# EAGLE design Axoloti1 (EAGLE 6.5.0)
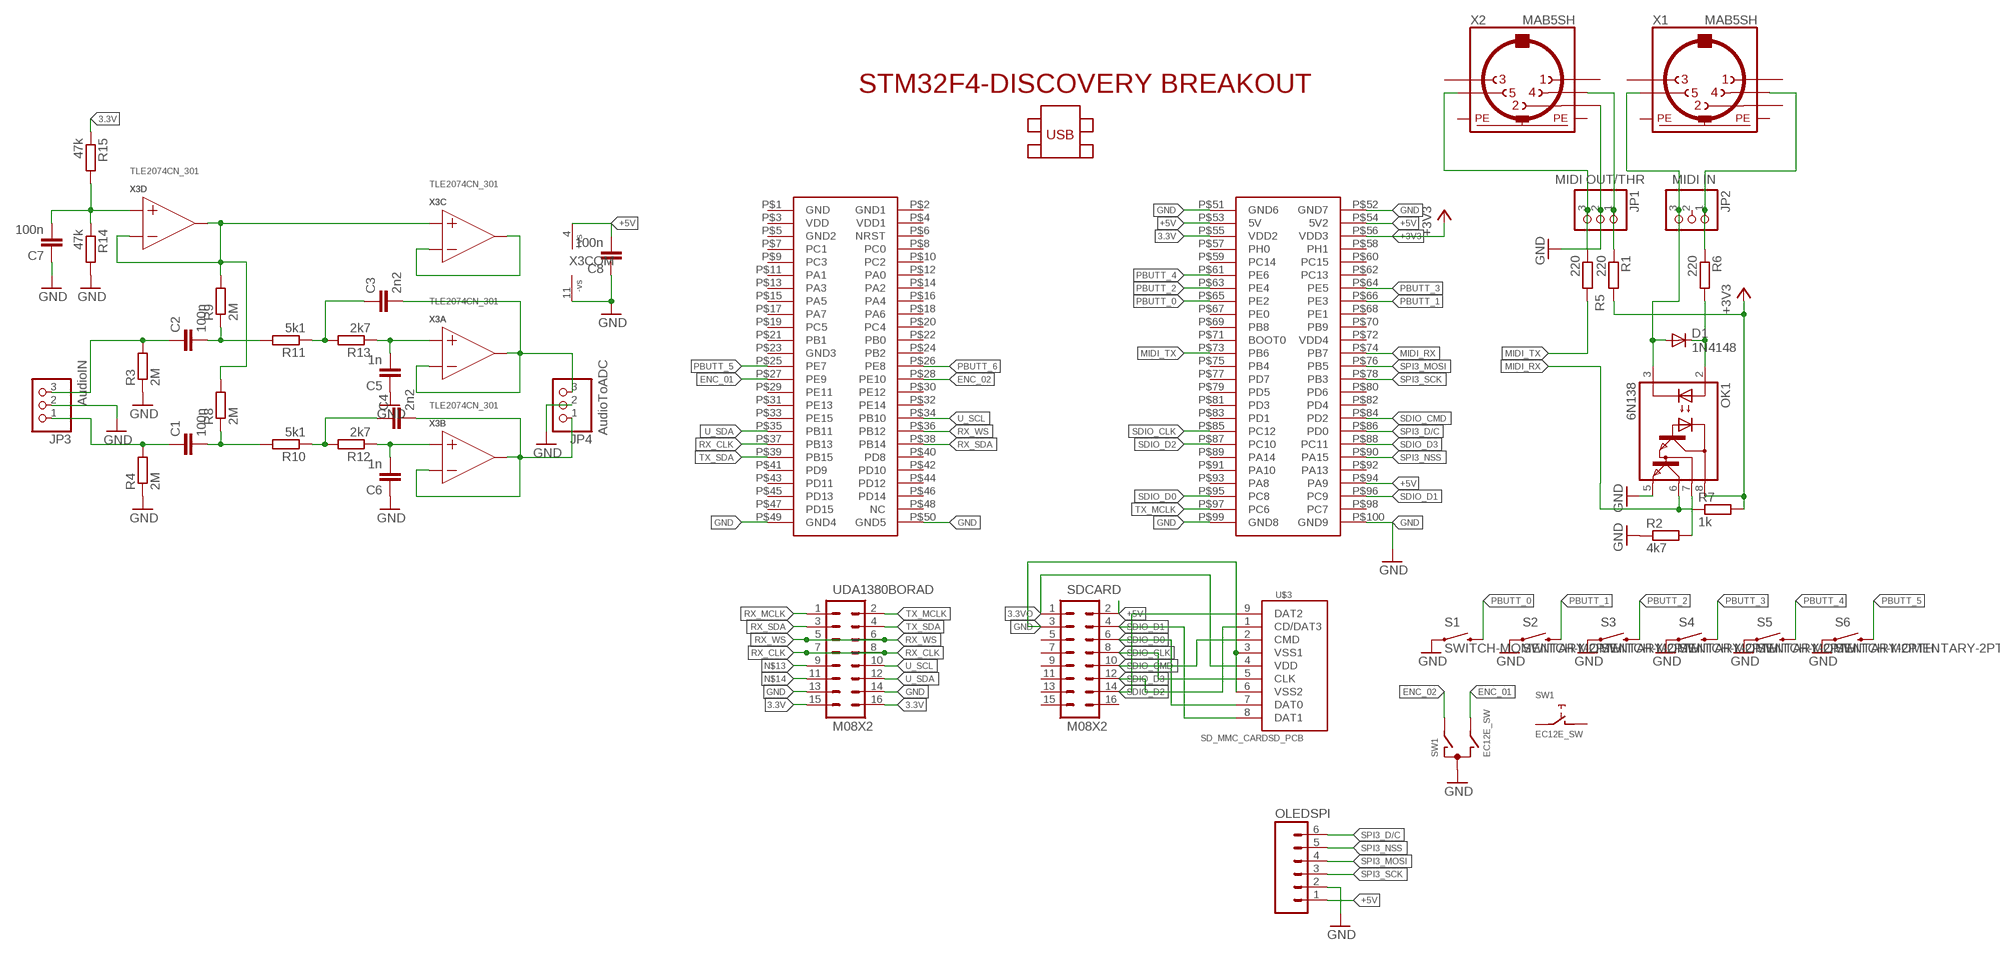
[diagram p0: schematic, sheet 1]

## Parts
C1  100n  C-EU025-025X050  [C025-025X050]
C2  100n  C-EU025-025X050  [C025-025X050]
C3  2n2  C-EU025-025X050  [C025-025X050]
C4  2n2  C-EU025-025X050  [C025-025X050]
C5  1n  C-EU025-025X050  [C025-025X050]
C6  1n  C-EU025-025X050  [C025-025X050]
C7  100n  C-EU025-025X050  [C025-025X050]
C8  100n  C-EU025-025X050  [C025-025X050]
D1  1N4148  1N4148DO35-7  [DO35-7]
JP1  MIDI OUT/THR  PINHD-1X3  [1X03]
JP2  MIDI IN  PINHD-1X3  [1X03]
JP3  AudioIN  PINHD-1X3  [1X03]
JP4  AudioToADC  PINHD-1X3  [1X03]
OK1  6N138  [DIL08]
OLEDSPI  M06SIP  [1X06]
R1  220  R-EU_0204/7  [0204/7]
R2  4k7  R-EU_0204/7  [0204/7]
R3  2M  R-EU_0204/7  [0204/7]
R4  2M  R-EU_0204/7  [0204/7]
R5  220  R-EU_0204/7  [0204/7]
R6  220  R-EU_0204/7  [0204/7]
R7  1k  R-EU_0204/7  [0204/7]
R8  2M  R-EU_0204/7  [0204/7]
R9  2M  R-EU_0204/7  [0204/7]
R10  5k1  R-EU_0204/7  [0204/7]
R11  5k1  R-EU_0204/7  [0204/7]
R12  2k7  R-EU_0204/7  [0204/7]
R13  2k7  R-EU_0204/7  [0204/7]
R14  47k  R-EU_0204/7  [0204/7]
R15  47k  R-EU_0204/7  [0204/7]
S1  SWITCH-MOMENTARY-2PTH  [TACTILE-PTH]
S2  SWITCH-MOMENTARY-2PTH  [TACTILE-PTH]
S3  SWITCH-MOMENTARY-2PTH  [TACTILE-PTH]
S4  SWITCH-MOMENTARY-2PTH  [TACTILE-PTH]
S5  SWITCH-MOMENTARY-2PTH  [TACTILE-PTH]
S6  SWITCH-MOMENTARY-2PTH  [TACTILE-PTH]
SDCARD  M08X2  [2X8]
SW1  EC12E_SW  [ALPS_EC12E_SW]
U$1  STM32F4-DISCOVERY  [STM32F4-DISCOVERY]
U$3  SD_MMC_CARDSD_PCB  [SD-MMC-CARD]
UDA1380BORAD  M08X2  [2X8]
X1  MAB5SH  [MAB5SH]
X2  MAB5SH  [MAB5SH]
X3  TLE2074CN_301  [DIL14]

## Nets
3.3V: R15.1 U$1.P$55(VDD2) UDA1380BORAD.15 UDA1380BORAD.16
3.3VO: SDCARD.1 U$3.4(VDD)
+3V3: OK1.8(VCC) R1.2 R7.2 U$1.P$56(VDD3)
+5V: C8.2 OLEDSPI.1 SDCARD.2 U$1.P$53(5V) U$1.P$54(5V2) U$1.P$94(PA9) X3.4(COM:+VS)
ENC_01: SW1.B U$1.P$27(PE9)
ENC_02: SW1.A U$1.P$28(PE10)
GND: C5.1 C6.1 C7.1 C8.1 JP1.2 JP3.2 JP4.2 OK1.5(GND) OLEDSPI.2 R2.1 R3.1 R4.1 R14.2 S1.1 S2.1 S3.1 S4.1 S5.1 S6.1 SDCARD.3 SW1.C U$1.P$49(GND4) U$1.P$50(GND5) U$1.P$51(GND6) U$1.P$52(GND7) U$1.P$99(GND8) U$1.P$100(GND9) U$3.3(VSS1) U$3.6(VSS2) UDA1380BORAD.13 UDA1380BORAD.14 X2.2 X3.11(COM:-VS)
MIDI_RX: OK1.6(VO) R7.1 U$1.P$74(PB7)
MIDI_TX: R5.2 U$1.P$73(PB6)
N$1: JP1.3 R5.1 X2.5
N$2: C4.2 JP4.1 X3.6(B:-IN) X3.7(B:OUT)
N$3: OK1.7(VB) R2.2
N$4: C3.2 JP4.3 X3.1(A:OUT) X3.2(A:-IN)
N$5: C5.2 R13.1 X3.3(A:+IN)
N$6: C3.1 R11.1 R13.2
N$7: C4.1 R10.1 R12.2
N$8: C6.2 R12.1 X3.5(B:+IN)
N$9: C2.2 R9.1 R11.2
N$10: C1.2 R8.1 R10.2
N$11: C1.1 JP3.1 R4.2
N$12: C2.1 JP3.3 R3.2
N$13: UDA1380BORAD.9
N$14: UDA1380BORAD.11
N$15: JP1.1 R1.1 X2.4
N$16: D1.A JP2.3 OK1.3(C) X1.5
N$18: D1.C OK1.2(A) R6.2
N$21: JP2.1 R6.1 X1.4
N$22: R8.2 R9.2 X3.10(C:+IN) X3.13(D:-IN) X3.14(D:OUT)
N$23: C7.2 R14.1 R15.2 X3.12(D:+IN)
N$24: X3.8(C:OUT) X3.9(C:-IN)
PBUTT_0: S1.3 U$1.P$65(PE2)
PBUTT_1: S2.3 U$1.P$66(PE3)
PBUTT_2: S3.3 U$1.P$63(PE4)
PBUTT_3: S4.3 U$1.P$64(PE5)
PBUTT_4: S5.3 U$1.P$61(PE6)
PBUTT_5: S6.3 U$1.P$25(PE7)
PBUTT_6: U$1.P$26(PE8)
RX_CLK: U$1.P$37(PB13) UDA1380BORAD.7 UDA1380BORAD.8
RX_MCLK: UDA1380BORAD.1
RX_SDA: U$1.P$38(PB14) UDA1380BORAD.3
RX_WS: U$1.P$36(PB12) UDA1380BORAD.5 UDA1380BORAD.6
SDIO_CLK: SDCARD.8 U$1.P$85(PC12) U$3.5(CLK)
SDIO_CMD: SDCARD.10 U$1.P$84(PD2) U$3.2(CMD)
SDIO_D0: SDCARD.6 U$1.P$95(PC8) U$3.7(DAT0)
SDIO_D1: SDCARD.4 U$1.P$96(PC9) U$3.8(DAT1)
SDIO_D2: SDCARD.14 U$1.P$87(PC10) U$3.9(DAT2)
SDIO_D3: SDCARD.12 U$1.P$88(PC11) U$3.1(CD/DAT3)
SPI3_D/C: OLEDSPI.6 U$1.P$86(PD0)
SPI3_MOSI: OLEDSPI.4 U$1.P$76(PB5)
SPI3_NSS: OLEDSPI.5 U$1.P$90(PA15)
SPI3_SCK: OLEDSPI.3 U$1.P$78(PB3)
TX_MCLK: U$1.P$97(PC6) UDA1380BORAD.2
TX_SDA: U$1.P$39(PB15) UDA1380BORAD.4
U_SCL: U$1.P$34(PB10) UDA1380BORAD.10
U_SDA: U$1.P$35(PB11) UDA1380BORAD.12
Unconnected: JP2.2 SDCARD.5 SDCARD.7 SDCARD.9 SDCARD.11 SDCARD.13 SDCARD.15 SDCARD.16 SW1.D SW1.E SW1.GND1(G) SW1.GND2(G) U$1.P$1(GND) U$1.P$2(GND1) U$1.P$3(VDD) U$1.P$4(VDD1) U$1.P$5(GND2) U$1.P$6(NRST) U$1.P$7(PC1) U$1.P$8(PC0) U$1.P$9(PC3) U$1.P$10(PC2) U$1.P$11(PA1) U$1.P$12(PA0) U$1.P$13(PA3) U$1.P$14(PA2) U$1.P$15(PA5) U$1.P$16(PA4) U$1.P$17(PA7) U$1.P$18(PA6) U$1.P$19(PC5) U$1.P$20(PC4) U$1.P$21(PB1) U$1.P$22(PB0) U$1.P$23(GND3) U$1.P$24(PB2) U$1.P$29(PE11) U$1.P$30(PE12) U$1.P$31(PE13) U$1.P$32(PE14) U$1.P$33(PE15) U$1.P$40(PD8) U$1.P$41(PD9) U$1.P$42(PD10) U$1.P$43(PD11) U$1.P$44(PD12) U$1.P$45(PD13) U$1.P$46(PD14) U$1.P$47(PD15) U$1.P$48(NC) U$1.P$57(PH0) U$1.P$58(PH1) U$1.P$59(PC14) U$1.P$60(PC15) U$1.P$62(PC13) U$1.P$67(PE0) U$1.P$68(PE1) U$1.P$69(PB8) U$1.P$70(PB9) U$1.P$71(BOOT0) U$1.P$72(VDD4) U$1.P$75(PB4) U$1.P$77(PD7) U$1.P$79(PD5) U$1.P$80(PD6) U$1.P$81(PD3) U$1.P$82(PD4) U$1.P$83(PD1) U$1.P$89(PA14) U$1.P$91(PA10) U$1.P$92(PA13) U$1.P$93(PA8) U$1.P$98(PC7) X1.1 X1.2 X1.3 X2.1 X2.3

## Power pins joined to a net without a drawn wire
PE: X1.PE X1.PE@(PE) X2.PE X2.PE@(PE)

## Library data of the parts
C1-C8 = rcl:C-EU: CAPACITOR, European symbol
D1 = diode:1N4148: DIODE high speed (Philips)
JP1-JP4 = pinhead:PINHD-1X3: PIN HEADER
OK1 = optocoupler:6N138: MOTOROLA OPTO COUPLER
OLEDSPI = SparkFun:M06: Header 6 Standard 6-pin 0.1" header. Use with straight break away headers (SKU : PRT-00116), right angle break away headers (PRT-00553), swiss pins (PRT-00743), machine pins (PRT-00117), and female headers (PRT-00115). Molex polarized connector foot print use with SKU : PRT-08094 with associated crimp pins and housings. NOTES ON THE VARIANTS LOCK and LOCK_LONGPADS... This footprint was designed to help hold the alignment of a through-hole component (i.e. 6-pin header) while soldering it into place. You may notice that each hole has been shifted either up or down by 0.005 of an inch from it's more standard position (which is a perfectly straight line). This slight alteration caused the pins (the squares in the middle) to touch the edges of the holes. Because they are alternating, it causes a "brace" to hold the component in place. 0.005 has proven to be the perfect amount of "off-center" position when using our standard breakaway headers. Although looks a little odd when you look at the bare footprint, once you have a header in there, the alteration is very hard to notice. Also, if you push a header all the way into place, it is covered up entirely on the bottom side. This idea of altering the position of holes to aid alignment will be further integrated into the Sparkfun Library for other footprints. It can help hold any component with 3 or more connection pins.
R1-R15 = rcl:R-EU_: RESISTOR, European symbol
S1-S6 = SparkFun:SWITCH-MOMENTARY-2
SDCARD UDA1380BORAD = SparkFun:M08X2
SW1 = switch-alps:EC12E_SW: ALPS rotary Encoder EC12E series with switch
U$1 = STM32F4-DISCOVERY:STM32F4-DISCOVERY
U$3 = SparkFun:SD_MMC_CARD
X1 X2 = con-hirschmann:MAB5SH: Female CONNECTOR 5 pins 90 deg. with shield, horizontal (DIN 41524)
X3 = bb_parts_OpAmp:TLE2074CN_301: Quad high speed biFET OpAmp. Category: OpAmp Manufacturer: Texas Instruments

## Board
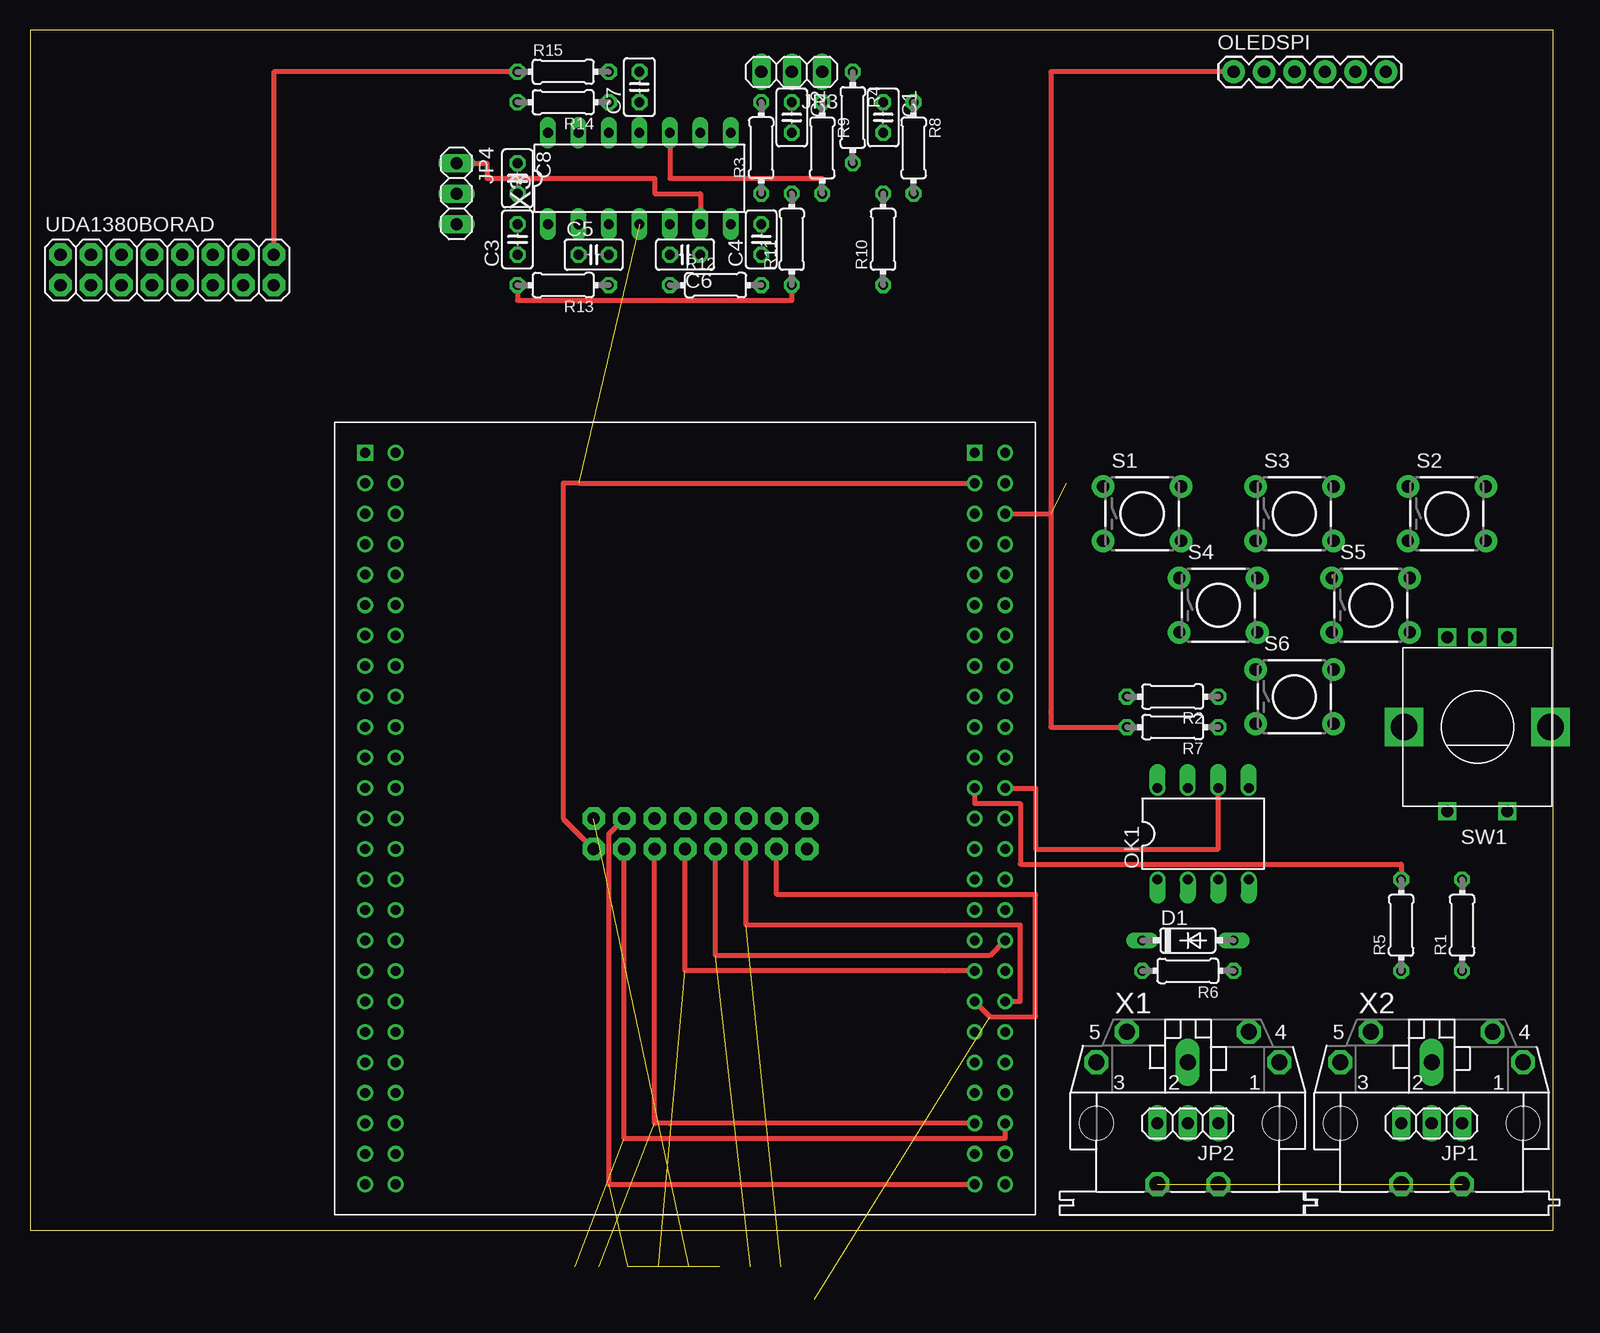
[diagram p1: board, top side]
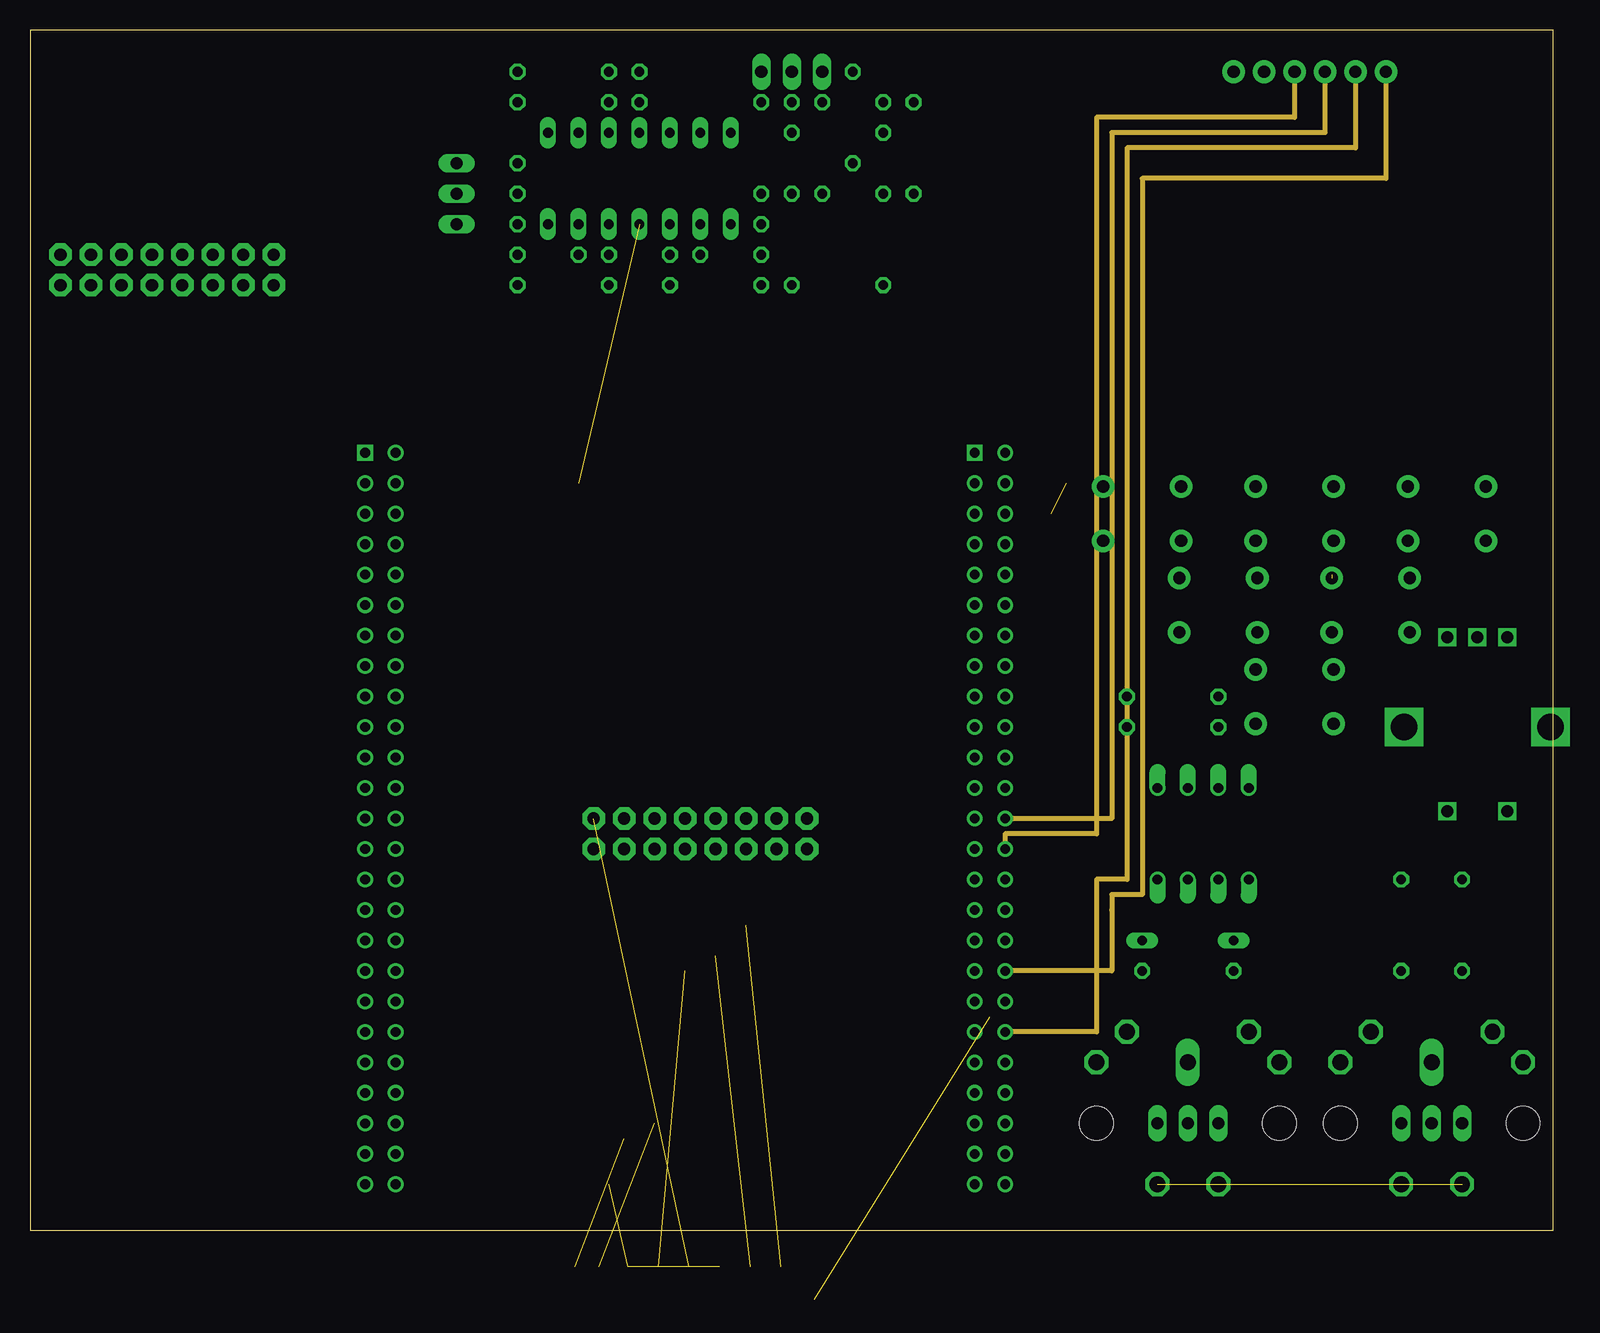
[diagram p2: board, inner layer Route2]
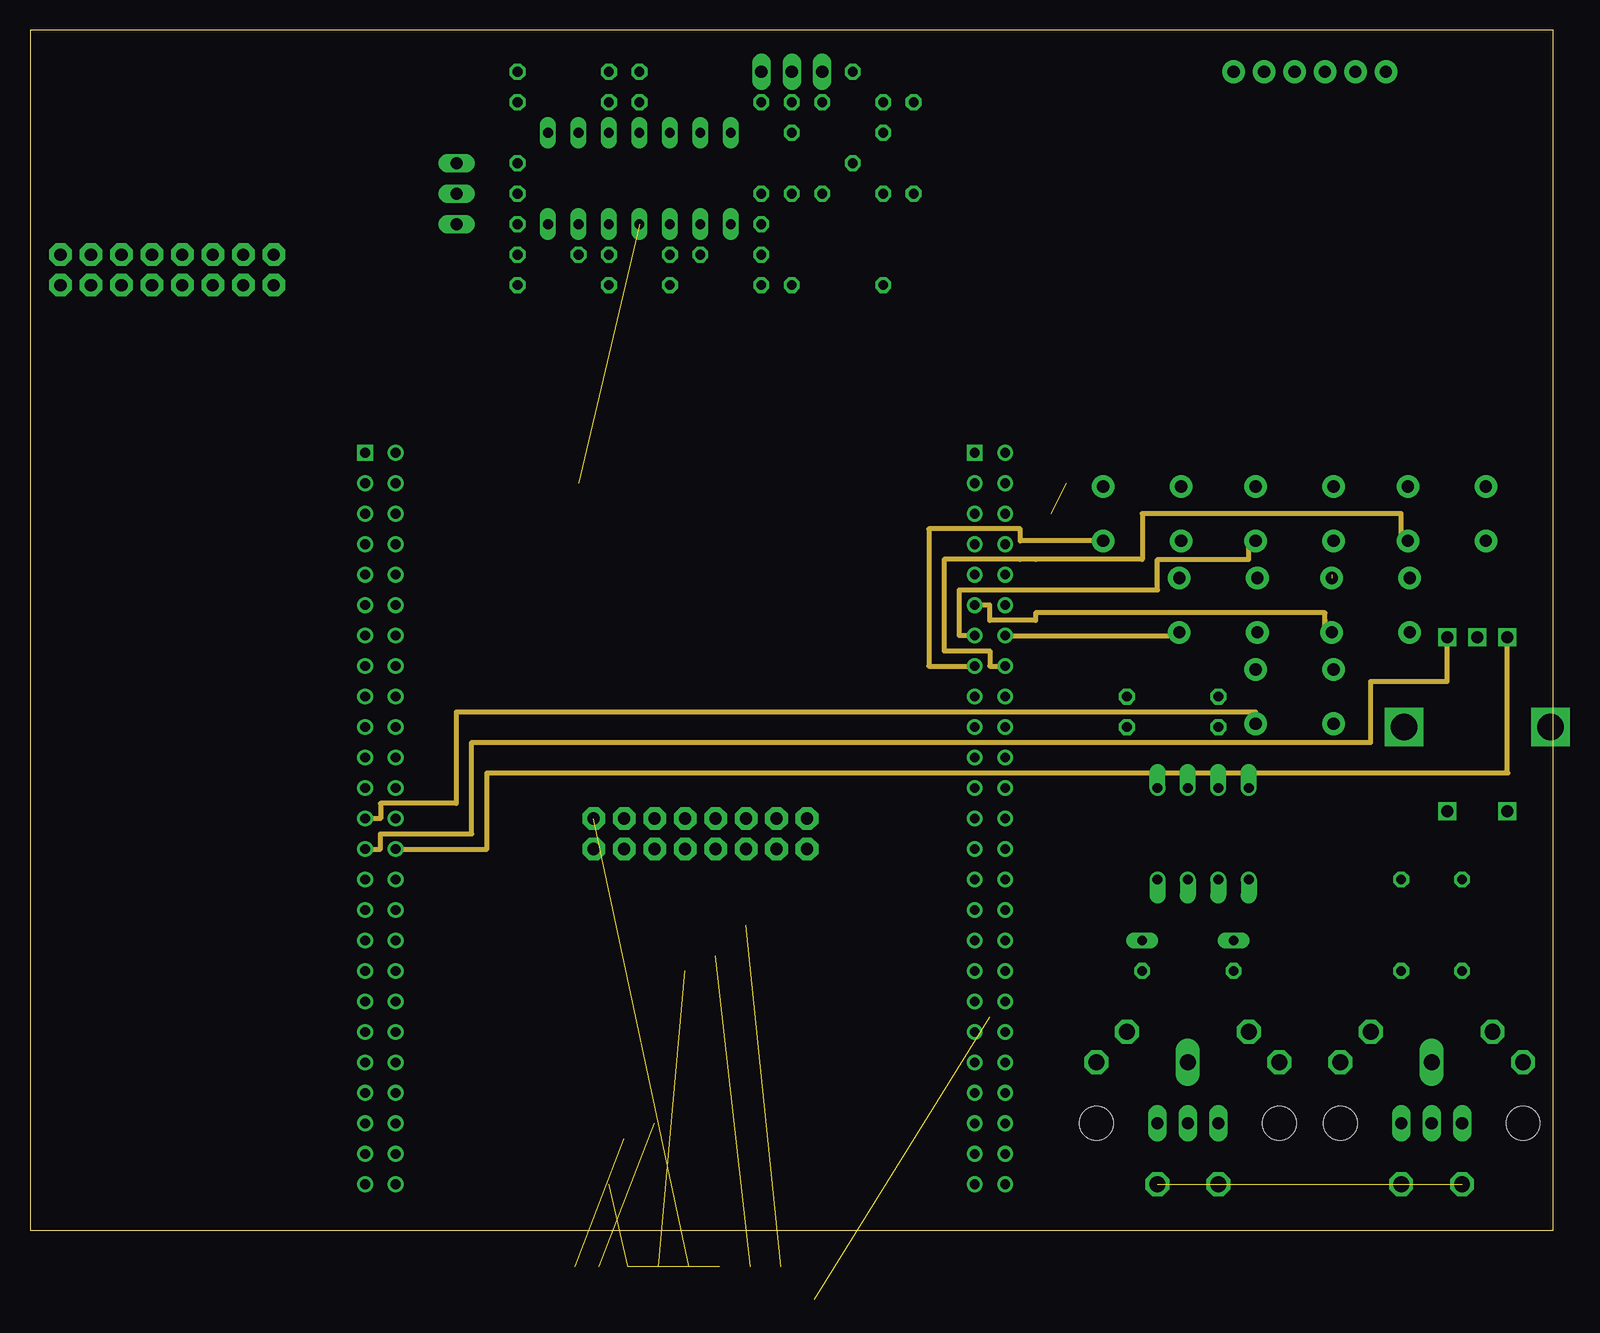
[diagram p3: board, inner layer Route15]
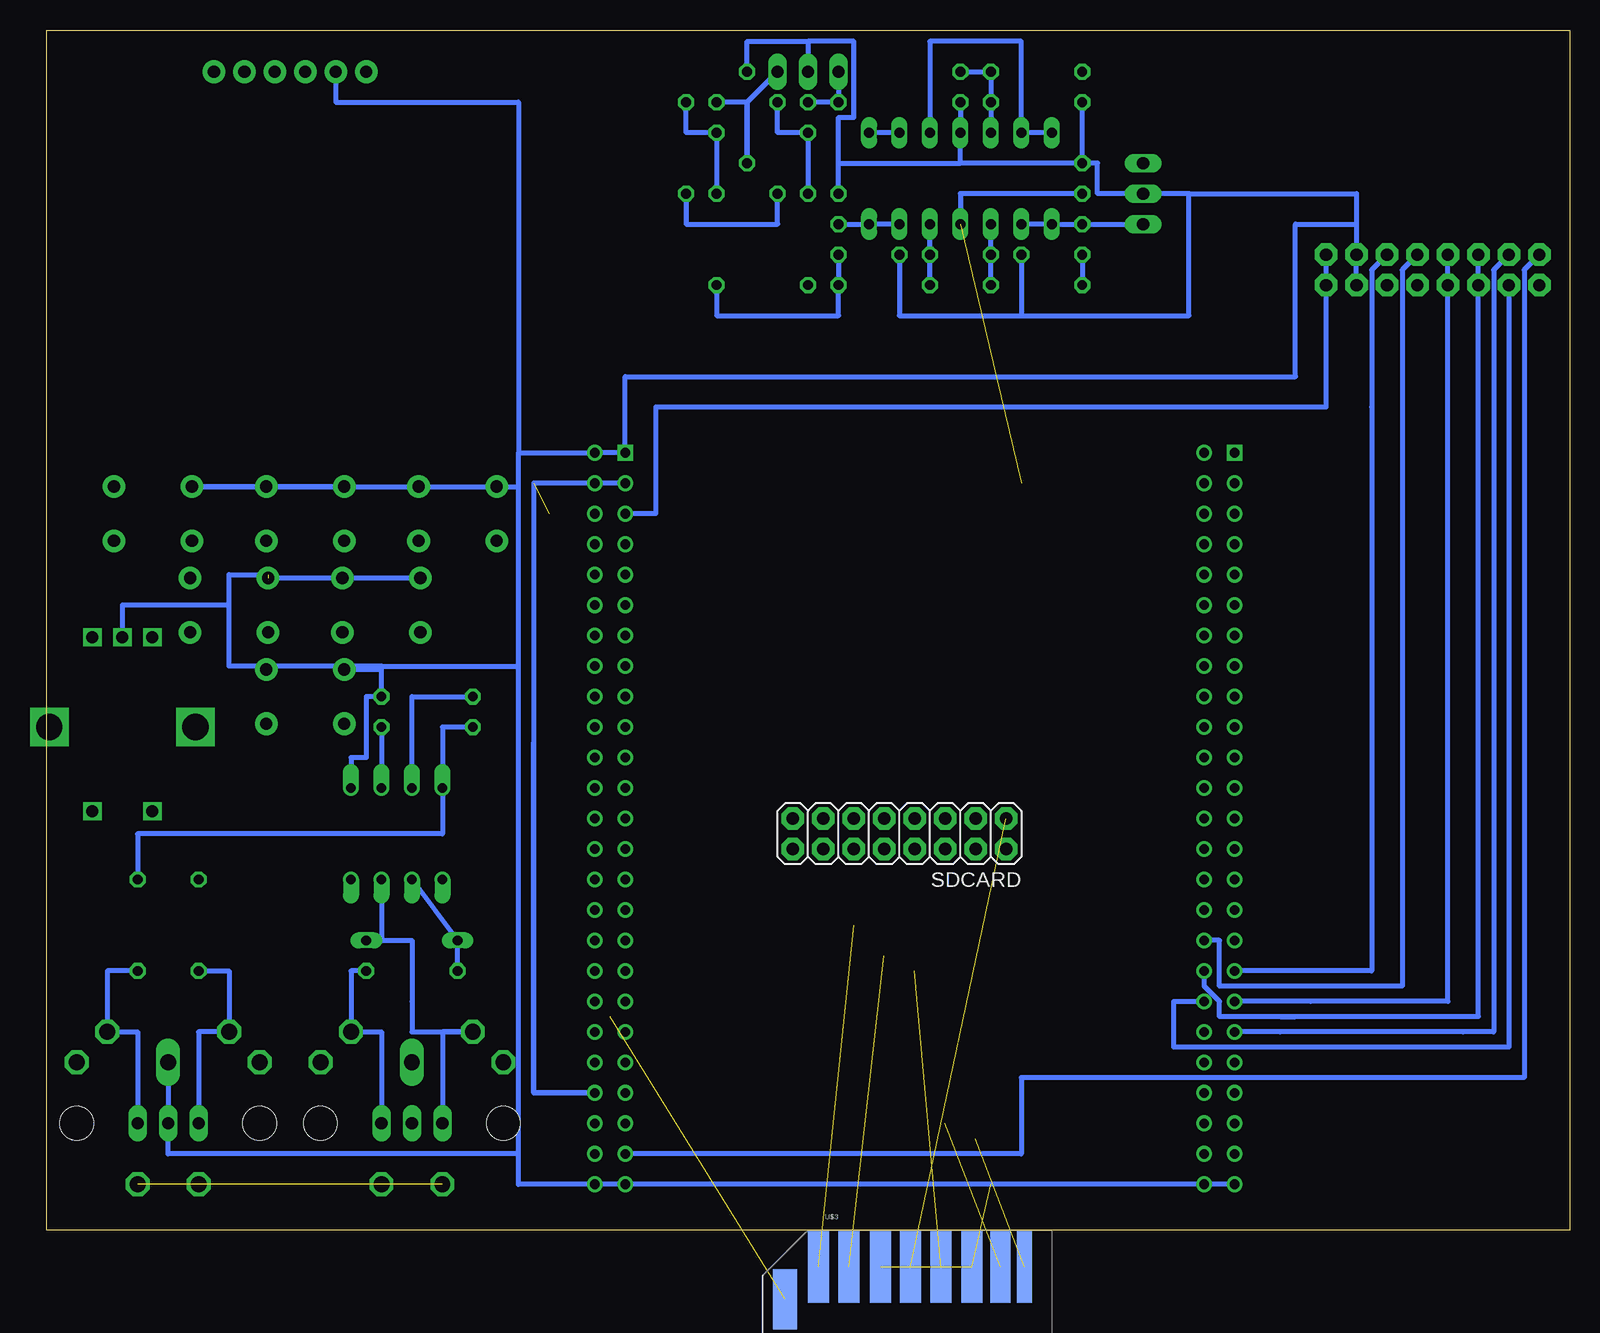
[diagram p4: board, bottom side, seen from below]

Size 126.98 x 100 mm. Coordinates in mm from the lower left corner, seen from the top.
Outline: 0,0 126.98,0 126.98,100 0,100 0,0
Copper layers (1*2)+(15*16): Top 0.035mm / dielectric 1.5mm / Route2 0.035mm / dielectric 0.15mm / Route15 0.035mm / dielectric 0.2mm / Bottom 0.035mm
Design rules "default *": minimum track width 10mil, minimum drill 24mil, track to track 8mil, track to pad 8mil, pad to pad 8mil, via to via 8mil, smd to smd 8mil, copper to edge 40mil, drill to drill 8mil, minimum pad ring 10mil, minimum via ring 8mil, stop-mask expansion 4mil, vias tented up to drill 0mil, thermal gap 10mil

### Footprints (pad centres in the part's own frame; a part is rotated, then mirrored left to right if it is on the bottom)
C025-025X050 = drill 0.813 octagon: 1 -1.27,0; 2 1.27,0
DO35-7 = drill 0.813 long: A 3.81,0; C -3.81,0
1X03 = drill 1.016 long: 1 -2.54,0; 2 0,0; 3 2.54,0
DIL08 = drill 0.813 offset: 1 -3.81,-3.81; 2 -1.27,-3.81; 3 1.27,-3.81; 4 3.81,-3.81; 5 3.81,3.81; 6 1.27,3.81; 7 -1.27,3.81; 8 -3.81,3.81
1X06 = drill 1.016 pad 1.88: 1 0,0; 2 2.54,0; 3 5.08,0; 4 7.62,0; 5 10.16,0; 6 12.7,0
0204/7 = drill 0.813 octagon: 1 -3.81,0; 2 3.81,0
TACTILE-PTH = drill 1.016 pad 1.88: 1 -3.251,2.261; 2 3.251,2.261; 3 -3.251,-2.261; 4 3.251,-2.261
2X8 = drill 1.016 pad 1.88 octagon: 1 0,0; 2 0,2.54; 3 2.54,0; 4 2.54,2.54; 5 5.08,0; 6 5.08,2.54; 7 7.62,0; 8 7.62,2.54; 9 10.16,0; 10 10.16,2.54; 11 12.7,0; 12 12.7,2.54; 13 15.24,0; 14 15.24,2.54; 15 17.78,0; 16 17.78,2.54
ALPS_EC12E_SW = drill 1 square: A -2.5,-7.5; B 2.5,-7.5; C 0,-7.5; D -2.5,7; E 2.5,7 | drill 2.2 square: GND1 -6.1,0; GND2 6.1,0
STM32F4-DISCOVERY = drill 0.8 square: P$1 -27.94,30.48; P$51 22.86,30.48 | drill 0.8: P$2 -25.4,30.48; P$3 -27.94,27.94; P$4 -25.4,27.94; P$5 -27.94,25.4; P$6 -25.4,25.4; P$7 -27.94,22.86; P$8 -25.4,22.86; P$9 -27.94,20.32; P$10 -25.4,20.32; P$11 -27.94,17.78; P$12 -25.4,17.78; P$13 -27.94,15.24; P$14 -25.4,15.24; P$15 -27.94,12.7; P$16 -25.4,12.7; P$17 -27.94,10.16; P$18 -25.4,10.16; P$19 -27.94,7.62; P$20 -25.4,7.62; P$21 -27.94,5.08; P$22 -25.4,5.08; P$23 -27.94,2.54; P$24 -25.4,2.54; P$25 -27.94,0; P$26 -25.4,0; P$27 -27.94,-2.54; P$28 -25.4,-2.54; P$29 -27.94,-5.08; P$30 -25.4,-5.08; P$31 -27.94,-7.62; P$32 -25.4,-7.62; P$33 -27.94,-10.16; P$34 -25.4,-10.16; P$35 -27.94,-12.7; P$36 -25.4,-12.7; P$37 -27.94,-15.24; P$38 -25.4,-15.24; P$39 -27.94,-17.78; P$40 -25.4,-17.78; P$41 -27.94,-20.32; P$42 -25.4,-20.32; P$43 -27.94,-22.86; P$44 -25.4,-22.86; P$45 -27.94,-25.4; P$46 -25.4,-25.4; P$47 -27.94,-27.94; P$48 -25.4,-27.94; P$49 -27.94,-30.48; P$50 -25.4,-30.48; P$52 25.4,30.48; P$53 22.86,27.94; P$54 25.4,27.94; P$55 22.86,25.4; P$56 25.4,25.4; P$57 22.86,22.86; P$58 25.4,22.86; P$59 22.86,20.32; P$60 25.4,20.32; P$61 22.86,17.78; P$62 25.4,17.78; P$63 22.86,15.24; P$64 25.4,15.24; P$65 22.86,12.7; P$66 25.4,12.7; P$67 22.86,10.16; P$68 25.4,10.16; P$69 22.86,7.62; P$70 25.4,7.62; P$71 22.86,5.08; P$72 25.4,5.08; P$73 22.86,2.54; P$74 25.4,2.54; P$75 22.86,0; P$76 25.4,0; P$77 22.86,-2.54; P$78 25.4,-2.54; P$79 22.86,-5.08; P$80 25.4,-5.08; P$81 22.86,-7.62; P$82 25.4,-7.62; P$83 22.86,-10.16; P$84 25.4,-10.16; P$85 22.86,-12.7; P$86 25.4,-12.7; P$87 22.86,-15.24; P$88 25.4,-15.24; P$89 22.86,-17.78; P$90 25.4,-17.78; P$91 22.86,-20.32; P$92 25.4,-20.32; P$93 22.86,-22.86; P$94 25.4,-22.86; P$95 22.86,-25.4; P$96 25.4,-25.4; P$97 22.86,-27.94; P$98 25.4,-27.94; P$99 22.86,-30.48; P$100 25.4,-30.48
SD-MMC-CARD = smd 1.75 x 6: 1 -6.745,14.713; 2 -4.195,14.703; 3 -1.6,14.703; 4 0.93,14.703; 5 3.465,14.703; 6 6.03,14.703 | smd 1.65 x 6: 7 8.43,14.703 | smd 1.25 x 6: 8 10.43,14.703 | smd 2 x 5: 9 -9.53,12.03
MAB5SH = drill 1.321 octagon: 1 7.62,5.08; 3 -7.62,5.08; 4 5.08,7.62; 5 -5.08,7.62; PE -2.54,-5.08; PE@ 2.54,-5.08 | drill 1.321 long: 2 0,5.08 | hole 2.794: 7.62,0; -7.62,0
DIL14 = drill 0.813 long: 1 -7.62,-3.81; 2 -5.08,-3.81; 3 -2.54,-3.81; 4 0,-3.81; 5 2.54,-3.81; 6 5.08,-3.81; 7 7.62,-3.81; 8 7.62,3.81; 9 5.08,3.81; 10 2.54,3.81; 11 0,3.81; 12 -2.54,3.81; 13 -5.08,3.81; 14 -7.62,3.81

### Placement (x,y rotation side)
C1  71.12,92.71 270 top
C2  63.5,92.71 270 top
C3  40.64,82.55 90 top
C4  60.96,82.55 90 top
C5  46.99,81.28 0 top
C6  54.61,81.28 180 top
C7  50.8,95.25 90 top
C8  40.64,87.63 270 top
D1  96.52,24.13 0 top
JP1  116.84,8.89 180 top
JP2  96.52,8.89 180 top
JP3  63.5,96.52 180 top
JP4  35.56,86.36 270 top
OK1  97.79,33.02 0 top
OLEDSPI  100.33,96.52 0 top
R1  119.38,25.4 90 top
R2  95.25,44.45 180 top
R3  60.96,90.17 90 top
R4  68.58,92.71 270 top
R5  114.3,25.4 90 top
R6  96.52,21.59 180 top
R7  95.25,41.91 180 top
R8  73.66,90.17 270 top
R9  66.04,90.17 270 top
R10  71.12,82.55 90 top
R11  63.5,82.55 90 top
R12  57.15,78.74 0 top
R13  44.45,78.74 180 top
R14  44.45,93.98 180 top
R15  44.45,96.52 0 top
S1  92.71,59.69 0 top
S2  118.11,59.69 0 top
S3  105.41,59.69 0 top
S4  99.06,52.07 0 top
S5  111.76,52.07 0 top
S6  105.41,44.45 0 top
SDCARD  46.99,34.29 180 bottom
SW1  120.65,41.91 180 top
U$1  55.88,34.29 0 top
U$3  55.88,-17.78 0 bottom  (outside the outline)
UDA1380BORAD  2.54,78.74 0 top
X1  96.52,8.89 0 top
X2  116.84,8.89 0 top
X3  50.8,87.63 0 top

### Tracks (layer width: path | path; a pad name or v marks a point on that pad's centre or on a via)
3.3V
  Top 0.406: R15.1 20.32,96.52 UDA1380BORAD.16
  Bottom 0.406: UDA1380BORAD.16 UDA1380BORAD.15 20.32,68.58 76.2,68.58 76.2,59.69 U$1.P$55
3.3VO  (1 unrouted)
+3V3
  Top 0.406: U$1.P$56 85.09,59.69 85.09,43.18 85.09,41.91 R7.2
  Bottom 0.406: R7.2 93.98,41.91 OK1.8 93.98,33.02 119.38,33.02 R1.2
+5V  (2 unrouted)
  Top 0.406: U$1.P$53 45.72,62.23 44.45,62.23 44.45,34.29 SDCARD.2 | OLEDSPI.1 85.09,96.52 85.09,59.69
  Bottom 0.406: U$1.P$53 U$1.P$54 86.36,62.23 86.36,40.64 | 86.36,40.64 86.36,11.43 | 86.36,11.43 U$1.P$94 86.36,11.43 | 86.36,11.43 86.36,40.64 | C8.2 50.8,86.36 X3.4
ENC_01
  Route15 0.406: U$1.P$27 29.21,31.75 29.21,33.02 36.83,33.02 36.83,40.64 111.76,40.64 111.76,45.72 118.07,45.72 | 118.07,45.72 118.11,45.72 | 118.11,45.72 118.07,45.72 | SW1.B 118.11,49.41 118.11,45.72
ENC_02
  Route15 0.406: U$1.P$28 38.1,31.75 38.1,38.1 118.11,38.1 | 118.11,38.1 118.15,38.1 | 118.11,38.1 123.19,38.1 123.15,38.1 SW1.A
GND  (3 unrouted)
  Top 0.406: U$1.P$99 48.26,3.81 48.26,33.02 SDCARD.3
  Bottom 0.406: UDA1380BORAD.13 UDA1380BORAD.14 17.78,83.82 | 17.78,83.82 22.86,83.82 22.86,71.12 78.74,71.12 U$1.P$51 U$1.P$52 87.63,64.77 | U$1.P$49 U$1.P$50 U$1.P$99 U$1.P$100 87.63,3.81 | 87.63,3.81 87.63,6.35 | 87.63,6.35 87.63,46.99 | 87.63,46.99 87.63,60.96 87.63,62.23 | 87.63,62.23 87.63,64.77 | OK1.5 101.6,39.37 100.33,39.37 100.33,44.45 R2.1 99.06,46.99 | 99.06,46.99 87.63,46.99 | 87.63,3.81 87.63,6.35 | 87.63,6.35 116.84,6.35 JP1.2 X2.2 | R4.1 68.58,99.06 63.5,99.06 | 63.5,99.06 JP3.2 | R3.1 60.96,88.9 | 60.96,88.9 50.8,88.9 | 50.8,88.9 X3.11 C7.1 | C8.1 50.8,88.9 | C8.1 39.37,88.9 39.37,86.36 JP4.2 31.75,86.36 | C8.1 R14.2 | 60.96,88.9 60.96,92.71 59.69,92.71 59.69,99.06 63.5,99.06 | C5.1 45.72,76.2 | 45.72,76.2 31.75,76.2 31.75,86.36 | C6.1 55.88,76.2 45.72,76.2 | 31.75,86.36 17.78,86.36 17.78,83.82 | 87.63,62.23 87.63,61.95 S1.1 S2.1 S3.1 | S6.1 99.06,46.71 99.06,46.99 | 99.06,46.99 111.76,46.99 | 111.76,46.99 111.76,54.61 108.51,54.61 | 111.76,46.99 111.76,52.07 120.65,52.07 SW1.C | OLEDSPI.2 102.87,93.98 87.63,93.98 87.63,64.77 | S4.1 S5.1
MIDI_RX
  Top 0.406: U$1.P$74 83.82,36.83 83.82,31.75 99.06,31.75 OK1.6
  Bottom 0.406: R7.1 OK1.6
MIDI_TX
  Top 0.406: U$1.P$73 78.74,35.56 82.55,35.56 82.55,30.48 114.3,30.48 R5.2
N$1
  Bottom 0.406: R5.1 111.76,21.59 X2.5 114.3,16.51 JP1.3
N$2
  Top 0.406: JP4.1 38.1,88.9 38.1,87.63 52.07,87.63 52.07,86.36 55.88,86.36 X3.6
  Bottom 0.406: C4.2 X3.7 X3.6
N$3
  Bottom 0.406: OK1.7 96.52,44.45 R2.2
N$4
  Bottom 0.406: X3.2 X3.1 C3.2 JP4.3
N$5
  Bottom 0.406: R13.1 C5.2 X3.3
N$6
  Top 0.406: R13.2 40.64,77.47 63.5,77.47 R11.1
  Bottom 0.406: C3.1 R13.2
N$7
  Bottom 0.406: R10.1 71.12,76.2 60.96,76.2 R12.2 C4.1
N$8
  Bottom 0.406: R12.1 C6.2 X3.5
N$9
  Bottom 0.406: R9.1 66.04,91.44 C2.2 R11.2
N$10
  Bottom 0.406: R8.1 73.66,91.44 C1.2 R10.2
N$11
  Bottom 0.406: JP3.1 68.58,93.98 | 68.58,93.98 R4.2 68.58,93.98 | 68.58,93.98 C1.1
N$12
  Bottom 0.406: JP3.3 R3.2 C2.1
N$15
  Bottom 0.406: R1.1 121.92,21.59 X2.4 119.38,16.51 JP1.1
N$16
  Bottom 0.406: OK1.3 99.06,24.13 D1.A 96.52,24.13 96.52,19.05 96.52,16.51 X1.5 93.98,16.51 JP2.3
N$18
  Bottom 0.406: OK1.2 D1.C R6.2
N$21
  Bottom 0.406: R6.1 101.6,21.59 X1.4 99.06,16.51 JP2.1
N$22
  Top 0.406: X3.10 53.34,87.63 66.04,87.63 R9.2
  Bottom 0.406: R8.2 73.66,83.82 66.04,83.82 R9.2 | X3.14 X3.13 45.72,99.06 53.34,99.06 X3.10
N$23
  Bottom 0.406: X3.12 R14.1 R15.2 C7.2
N$24
  Bottom 0.406: X3.9 X3.8
PBUTT_0
  Route15 0.406: S1.3 82.55,57.43 82.55,58.42 74.93,58.42 74.93,46.99 U$1.P$65
PBUTT_1
  Route15 0.406: S2.3 114.3,57.43 114.3,57.15 114.3,59.69 92.71,59.69 92.71,55.88 83.82,55.88 82.55,55.88 76.2,55.88 76.2,49.53 76.2,48.26 80.01,48.26 80.01,46.99 U$1.P$66
PBUTT_2
  Route15 0.406: U$1.P$63 77.47,49.53 77.47,53.34 93.98,53.34 93.98,55.88 101.6,55.88 101.6,56.87 S3.3
PBUTT_3
  Route15 0.406: U$1.P$64 95.53,49.53 S4.3
PBUTT_4
  Route15 0.406: S5.3 107.95,49.81 107.95,50.8 107.95,51.44 83.82,51.44 83.82,50.8 80.01,50.8 80.01,52.07 U$1.P$61
PBUTT_5
  Route15 0.406: S6.3 102.16,43.18 101.6,43.18 35.56,43.18 35.56,35.56 29.21,35.56 29.21,34.29 U$1.P$25
PE  (3 unrouted)
RX_CLK
  Bottom 0.406: U$1.P$37 21.59,19.05 10.16,19.05 UDA1380BORAD.7 UDA1380BORAD.8
RX_SDA
  Bottom 0.406: UDA1380BORAD.3 5.08,15.24 25.4,15.24 33.02,15.24 33.02,19.05 U$1.P$38
RX_WS
  Bottom 0.406: 24.13,17.78 7.62,17.78 UDA1380BORAD.5 UDA1380BORAD.6 | 24.13,17.78 22.86,17.78 24.13,17.78 | 24.13,17.78 29.21,17.78 29.21,19.05 30.48,20.32 U$1.P$36
SDIO_CLK  (1 unrouted)
  Top 0.406: U$1.P$85 76.2,21.59 54.61,21.59 SDCARD.8
SDIO_CMD  (1 unrouted)
  Top 0.406: U$1.P$84 80.01,22.86 76.2,22.86 57.15,22.86 SDCARD.10
SDIO_D0  (1 unrouted)
  Top 0.406: U$1.P$95 53.34,8.89 52.07,8.89 SDCARD.6
SDIO_D1  (1 unrouted)
  Top 0.406: U$1.P$96 81.28,7.62 49.53,7.62 SDCARD.4
SDIO_D2  (1 unrouted)
  Top 0.406: U$1.P$87 80.01,17.78 83.82,17.78 83.82,27.94 62.23,27.94 SDCARD.14
SDIO_D3  (1 unrouted)
  Top 0.406: U$1.P$88 82.55,19.05 82.55,24.13 82.55,25.4 59.69,25.4 SDCARD.12
SPI3_D/C
  Route2 0.406: OLEDSPI.6 113.03,87.63 92.71,87.63 92.71,27.94 90.17,27.94 90.17,26.67 90.17,21.59 U$1.P$86
SPI3_MOSI
  Route2 0.406: OLEDSPI.4 107.95,91.44 90.17,91.44 90.17,34.29 U$1.P$76
SPI3_NSS
  Route2 0.406: OLEDSPI.5 110.49,90.17 91.44,90.17 91.44,29.21 88.9,29.21 88.9,16.51 U$1.P$90
SPI3_SCK
  Route2 0.406: OLEDSPI.3 105.41,92.71 88.9,92.71 88.9,33.02 81.28,33.02 U$1.P$78
TX_MCLK
  Bottom 0.406: UDA1380BORAD.2 3.81,80.01 3.81,12.7 45.72,12.7 45.72,6.35 U$1.P$97
TX_SDA
  Bottom 0.406: UDA1380BORAD.4 6.35,80.01 6.35,16.51 8.89,16.51 24.13,16.51 U$1.P$39
U_SCL
  Bottom 0.406: UDA1380BORAD.10 13.97,80.01 13.97,20.32 29.21,20.32 29.21,24.13 U$1.P$34
U_SDA
  Bottom 0.406: UDA1380BORAD.12 16.51,80.01 16.51,68.58 16.51,21.59 U$1.P$35